# EAGLE design Huzzah-ESP8266-Motor-Driver-v1 (EAGLE 7.5.0)
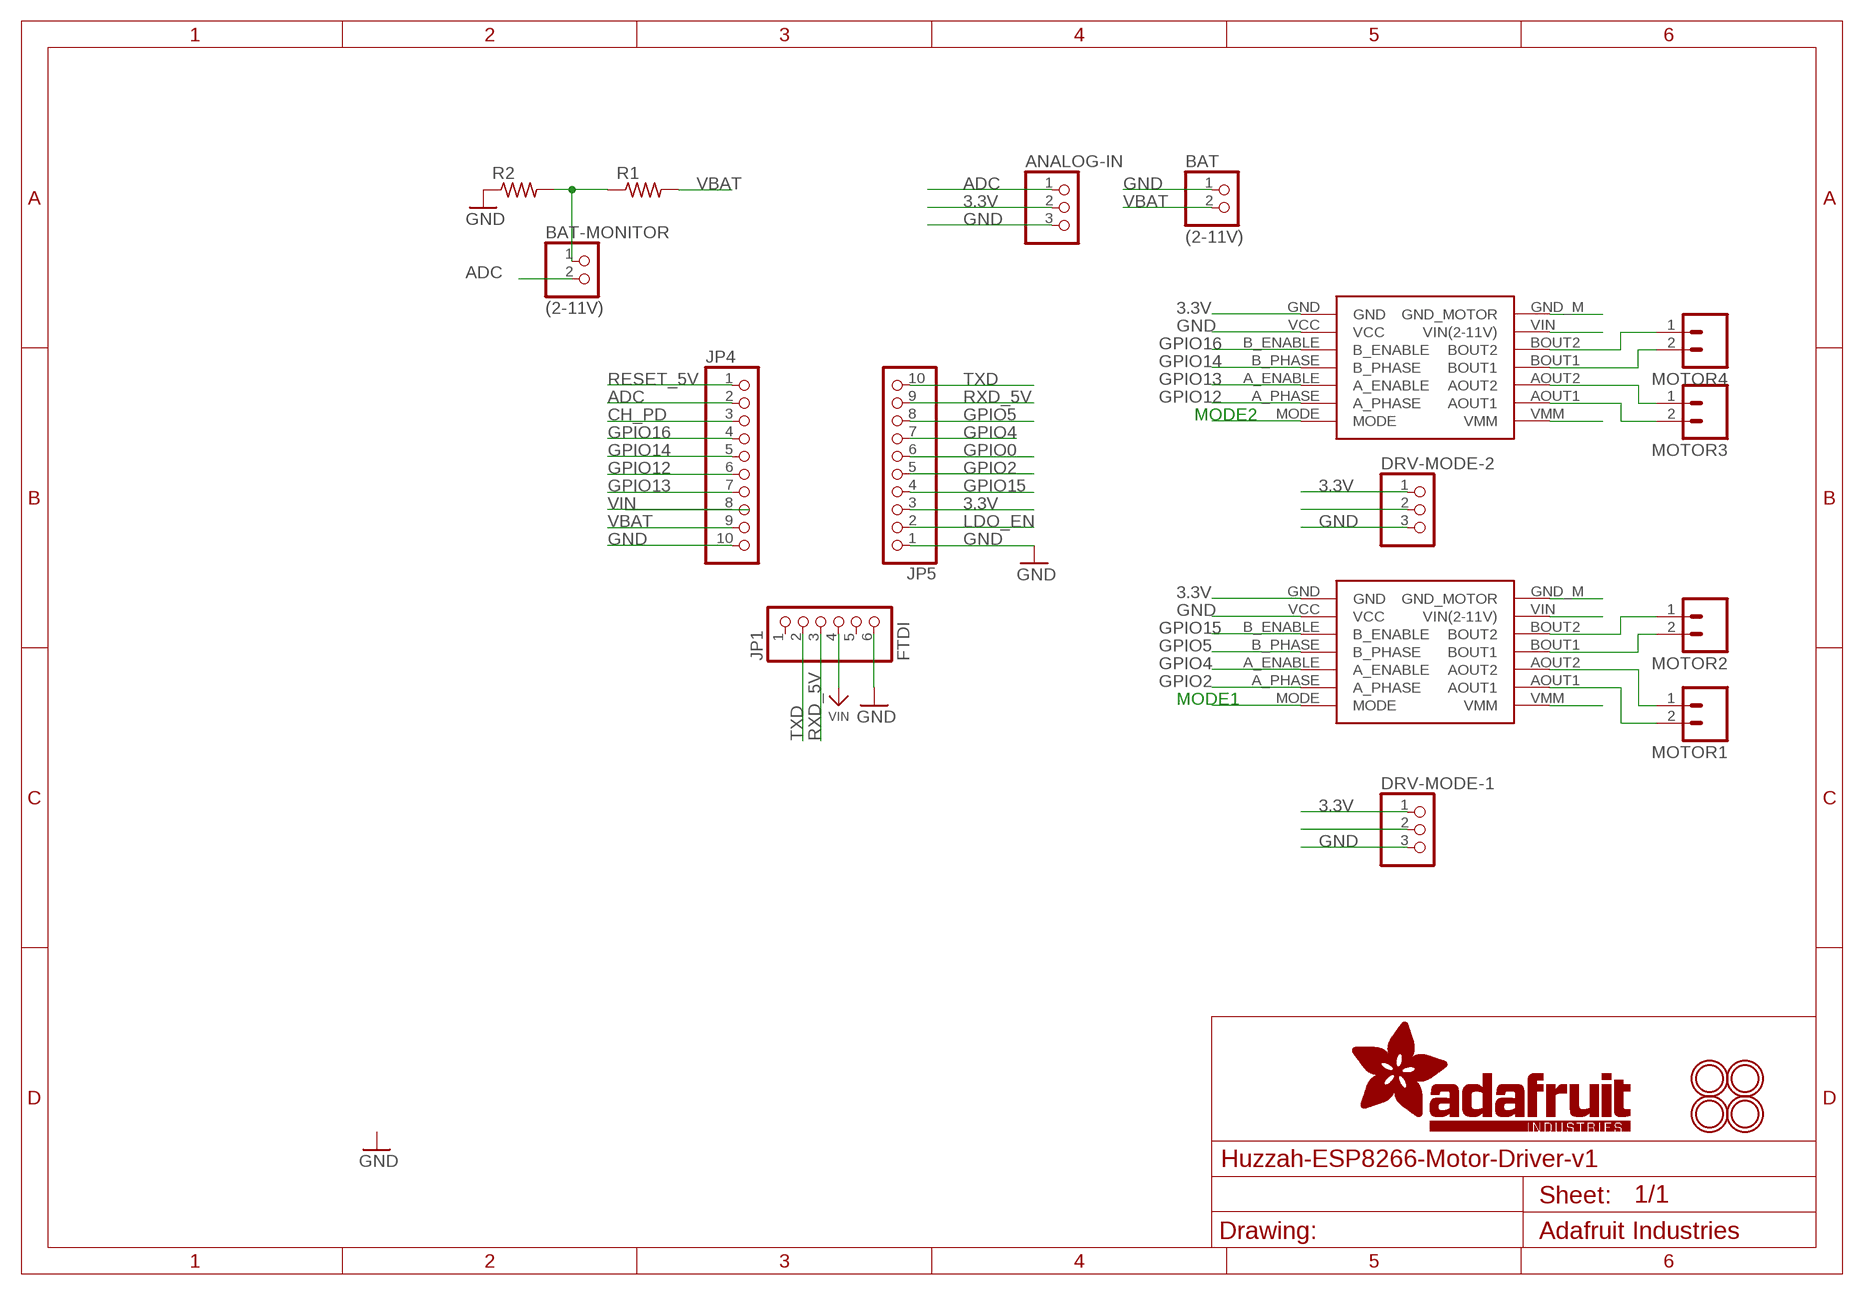
[diagram p0: schematic, sheet 1]

## Parts
ANALOG-IN  PINHD-1X3  [1X03]
BAT  (2-11V)  PINHD-1X2  [1X02]
BAT-MONITOR  (2-11V)  PINHD-1X2  [1X02]
DRV8835-1  POLOLU_DRV8835  [POLOLU_DRV8835]
DRV8835-2  POLOLU_DRV8835  [POLOLU_DRV8835]
DRV-MODE-1  PINHD-1X3  [1X03]
DRV-MODE-2  PINHD-1X3  [1X03]
JP1  FTDI  HEADER-1X670MIL  [1X06_ROUND_70]
JP4  HEADER-1X1070MIL  [1X10_ROUND70]
JP5  HEADER-1X1070MIL  [1X10_ROUND70]
MOTOR1  M02SPRING-2.54-RA  [SPRINGTERMINAL-2.54MM-2]
MOTOR2  M02SPRING-2.54-RA  [SPRINGTERMINAL-2.54MM-2]
MOTOR3  M02SPRING-2.54-RA  [SPRINGTERMINAL-2.54MM-2]
MOTOR4  M02SPRING-2.54-RA  [SPRINGTERMINAL-2.54MM-2]
R1  R-US_0204/5  [0204/5]
R2  R-US_0204/5  [0204/5]
U$15  MOUNTINGHOLE2.5  [MOUNTINGHOLE_2.5_PLATED]
U$16  MOUNTINGHOLE2.5  [MOUNTINGHOLE_2.5_PLATED]
U$17  MOUNTINGHOLE2.5  [MOUNTINGHOLE_2.5_PLATED]
U$18  MOUNTINGHOLE2.5  [MOUNTINGHOLE_2.5_PLATED]

## Nets
3.3V: ANALOG-IN.2 DRV8835-1.VCC DRV8835-2.VCC DRV-MODE-1.1 DRV-MODE-2.1 JP5.3
ADC: ANALOG-IN.1 BAT-MONITOR.2 JP4.2
CH_PD: JP4.3
GND: ANALOG-IN.3 BAT.1 DRV8835-1.GND DRV8835-1.GND_M(GND_MOTOR) DRV8835-2.GND DRV8835-2.GND_M(GND_MOTOR) DRV-MODE-1.3 DRV-MODE-2.3 JP1.6 JP4.10 JP5.1 R2.1
GPIO0: JP5.6
GPIO2: JP5.5
GPIO4: JP5.7
GPIO5: JP5.8
GPIO12: JP4.6
GPIO13: JP4.7
GPIO14: JP4.5
GPIO15: JP5.4
GPIO16: JP4.4
LDO_EN: JP5.2
MODE1: DRV8835-1.MODE
MODE2: DRV8835-2.MODE
N$1 [high-current]: DRV8835-1.AOUT1 MOTOR1.2
N$2 [high-current]: DRV8835-1.AOUT2 MOTOR1.1
N$3 [high-current]: DRV8835-1.BOUT1 MOTOR2.2
N$4 [high-current]: DRV8835-1.BOUT2 MOTOR2.1
N$5 [high-current]: DRV8835-2.AOUT1 MOTOR3.2
N$6 [high-current]: DRV8835-2.AOUT2 MOTOR3.1
N$7 [high-current]: DRV8835-2.BOUT2 MOTOR4.1
N$8: DRV8835-2.BOUT1 MOTOR4.2
N$9: DRV8835-1.A_ENABLE
N$10: DRV8835-1.A_PHASE
N$11: DRV8835-1.B_PHASE
N$12: DRV8835-1.B_ENABLE
N$13: DRV8835-2.A_PHASE
N$14: DRV8835-2.A_ENABLE
N$15: DRV8835-2.B_PHASE
N$16: DRV8835-2.B_ENABLE
N$17: BAT-MONITOR.1 R1.1 R2.2
N$19: DRV-MODE-2.2
N$20: DRV-MODE-1.2
N$21: DRV8835-2.VMM
N$24: DRV8835-1.VMM
RESET_5V: JP4.1
RXD_5V: JP1.3 JP5.9
TXD: JP1.2 JP5.10
VBAT [high-current]: BAT.2 DRV8835-1.VIN(VIN(2-11V)) DRV8835-2.VIN(VIN(2-11V)) JP4.9 R1.2
VIN: JP1.4 JP4.8
Unconnected: JP1.1 JP1.5

## Notes on the sheet
- MODE2
- MODE1

## Library data of the parts
ANALOG-IN DRV-MODE-1 DRV-MODE-2 = adafruit:PINHD-1X3: PIN HEADER
BAT BAT-MONITOR = pinhead:PINHD-1X2: PIN HEADER
DRV8835-1 DRV8835-2 = CMU-ArtFab:POLOLU_DRV8835
JP1 = microbuilder:HEADER-1X6: PIN HEADER
JP4 JP5 = microbuilder:HEADER-1X10: PIN HEADER
MOTOR1-MOTOR4 = CMU-ArtFab:M02: Header 2 Standard 2-pin 0.1" header. Use with straight break away headers (SKU : PRT-00116), right angle break away headers (PRT-00553), swiss pins (PRT-00743), machine pins (PRT-00117), and female headers (PRT-00115). Molex polarized connector foot print use with SKU : PRT-08233 with associated crimp pins and housings.
R1 R2 = resistor:R-US_: RESISTOR, American symbol
U$15-U$18 = microbuilder:MOUNTINGHOLE: Mounting Hole For #2 screws (0.086"/2.18mm width, 0.094"/2.4mm hole) use 2.5mm; BOM: EXCLUDE

## Net classes
0 default: width 0.152 mm
1 high-current: width 0.305 mm

## Board
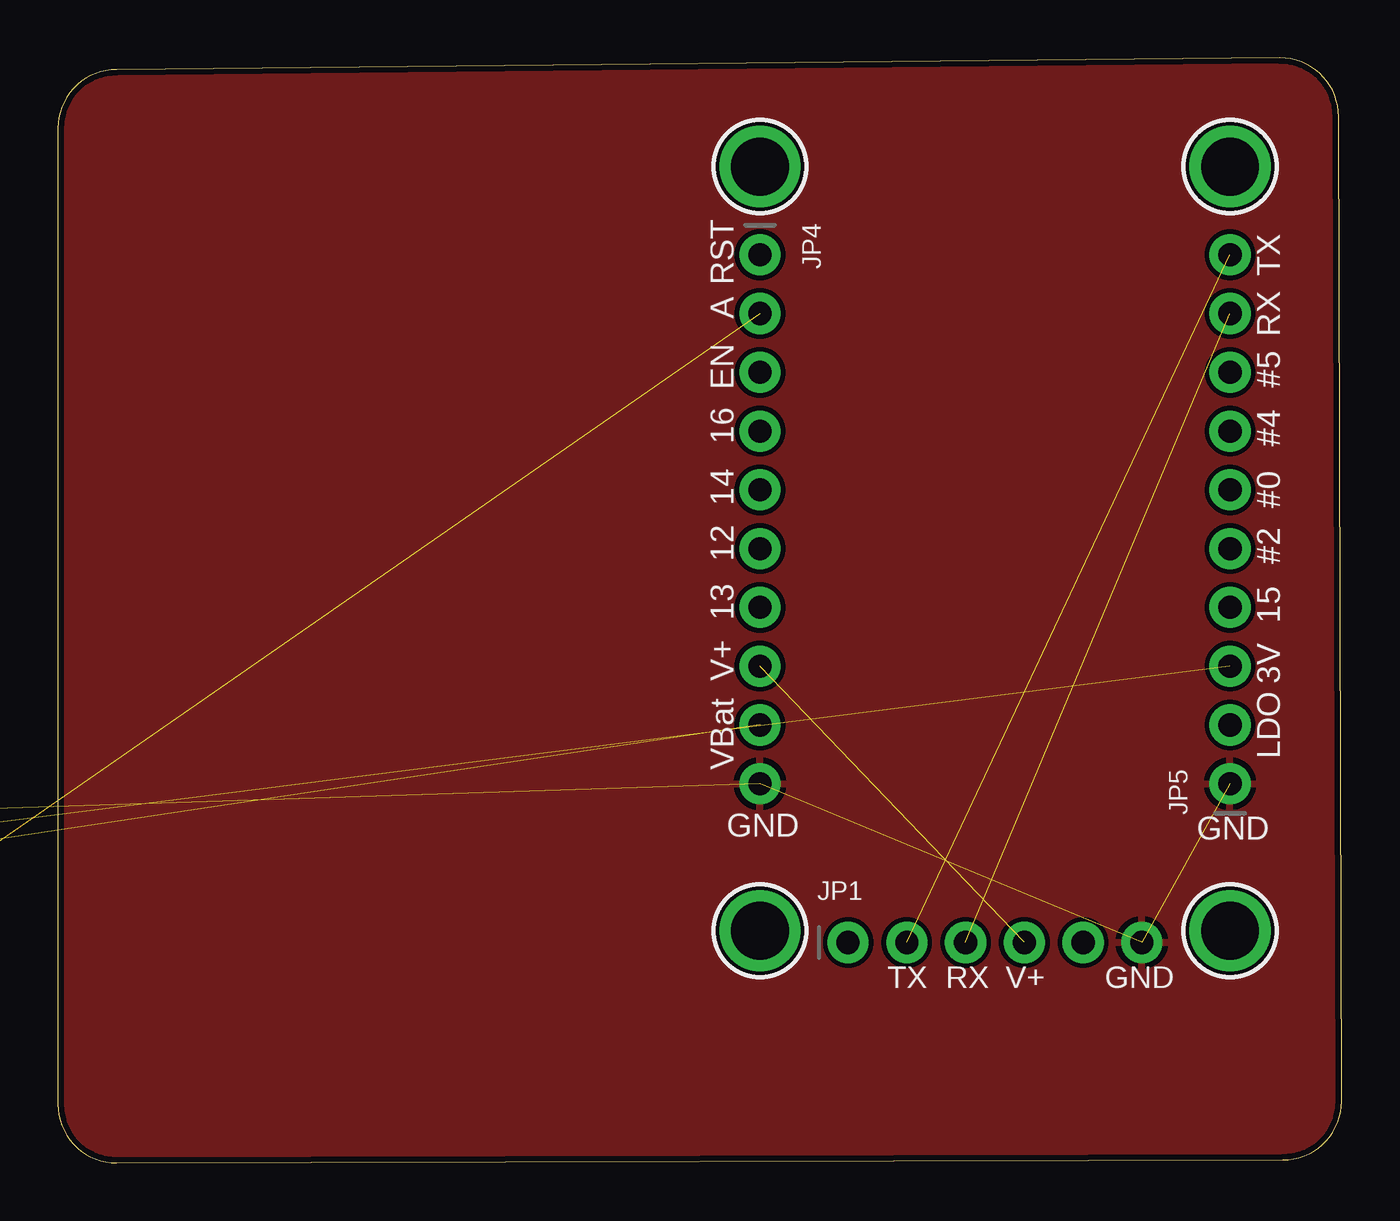
[diagram p1: board, top side]
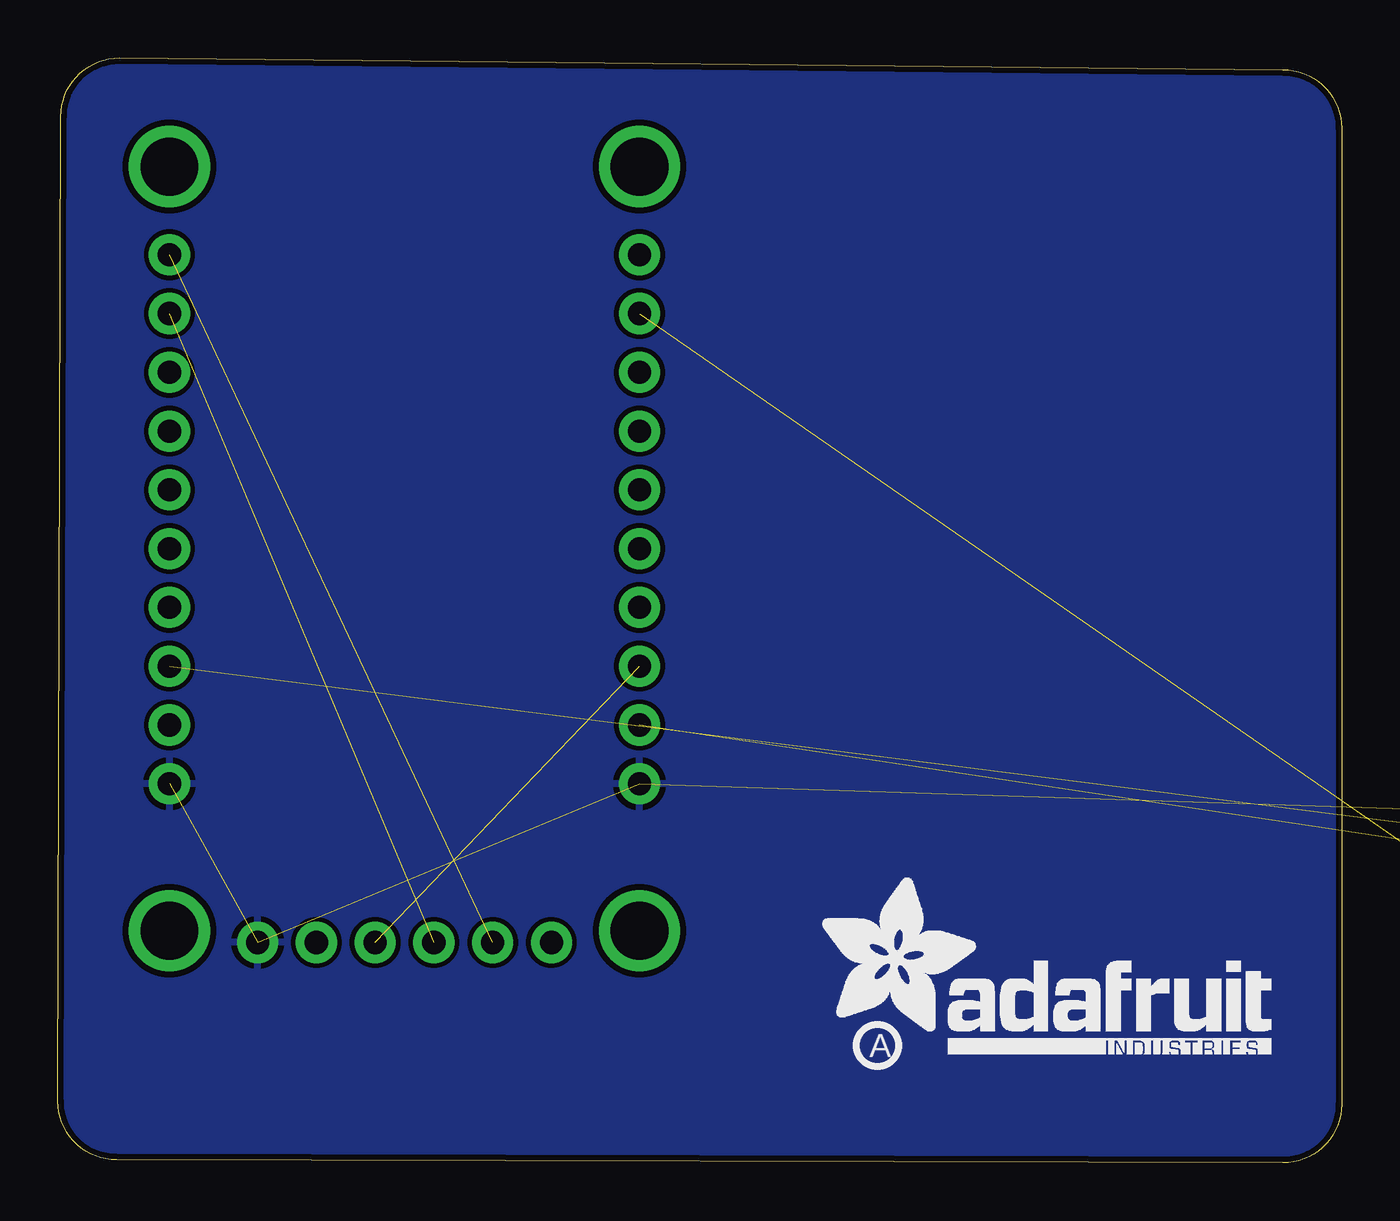
[diagram p2: board, bottom side, seen from below]

Size 55.5 x 47.75 mm. Coordinates in mm from the lower left corner, seen from the top.
Outline: 0,44.7 0,2.54 arc90 2.54,0 52.96,0.13 arc90 55.5,2.67 55.37,45.21 arc90 52.83,47.75 2.54,47.24 arc90 0,44.7
Copper layers (1*16): Top 0.035mm / dielectric 1.5mm / Bottom 0.035mm
Design rules "adafruit *": minimum track width 10mil, minimum drill 15.5mil, track to track 8mil, track to pad 8mil, pad to pad 8mil, via to via 8mil, smd to smd 8mil, copper to edge 10mil, drill to drill 8mil, minimum pad ring 10mil, minimum via ring 8mil, stop-mask expansion 2mil, vias tented up to drill 20mil, thermal gap 10mil

### Footprints (pad centres in the part's own frame; a part is rotated, then mirrored left to right if it is on the bottom)
1X03 = drill 1.016: 1 -2.54,0; 2 0,0; 3 2.54,0
1X02 = drill 1.016 long: 1 -1.27,0; 2 1.27,0
POLOLU_DRV8835 = drill 1.016 pad 1.778: A_ENABLE -3.81,-3.81; A_PHASE -3.81,-6.35; AOUT1 3.81,-6.35; AOUT2 3.81,-3.81; B_ENABLE -3.81,1.27; B_PHASE -3.81,-1.27; BOUT1 3.81,-1.27; BOUT2 3.81,1.27; MODE -3.81,-8.89; VCC -3.81,3.81; VIN 3.81,3.81; VMM 3.81,-8.89 | drill 1.016 pad 1.778 square: GND -3.81,6.35; GND_M 3.81,6.35
1X06_ROUND_70 = drill 1 pad 1.778: 1 -6.35,0; 2 -3.81,0; 3 -1.27,0; 4 1.27,0; 5 3.81,0; 6 6.35,0
1X10_ROUND70 = drill 1 pad 1.778: 1 -11.43,0; 2 -8.89,0; 3 -6.35,0; 4 -3.81,0; 5 -1.27,0; 6 1.27,0; 7 3.81,0; 8 6.35,0; 9 8.89,0; 10 11.43,0
SPRINGTERMINAL-2.54MM-2 = drill 1.1 pad 1.9: 1 0,0; 2 2.54,0; P$2 0,5.08; P$3 2.54,5.08
0204/5 = drill 0.813 octagon: 1 -2.54,0; 2 2.54,0
MOUNTINGHOLE_2.5_PLATED = drill 2.5 pad 3.2: P$1 0,0

### Placement (x,y rotation side)
ANALOG-IN  -27.56,-5.21 0 top  (outside the outline)
BAT  -60.83,-20.07 0 top  (outside the outline)
BAT-MONITOR  -60.83,-34.42 0 top  (outside the outline)
DRV8835-1  -26.92,8.64 0 top  (outside the outline)
DRV8835-2  -16.64,8.64 0 top  (outside the outline)
DRV-MODE-1  -59.56,-10.16 0 top  (outside the outline)
DRV-MODE-2  -59.56,-15.11 0 top  (outside the outline)
JP1  40.51,9.53 0 top
JP4  30.35,27.81 270 top
JP5  50.67,27.81 90 top
MOTOR1  -43.69,-1.65 0 top  (outside the outline)
MOTOR2  -35.69,-1.65 0 top  (outside the outline)
MOTOR3  -59.69,-1.65 0 top  (outside the outline)
MOTOR4  -51.69,-1.65 0 top  (outside the outline)
R1  -60.33,-26.29 0 top  (outside the outline)
R2  -60.33,-29.84 0 top  (outside the outline)
U$2  [HUZZAHLOGO]  21.59,30.61 0 bottom
U$12  [ADAFRUIT_TEXT_20MM]  22.61,4.7 0 bottom
U$13  [PCBFEAT-REV-040]  20.07,5.08 0 bottom
U$15  50.67,43.05 0 top
U$16  30.35,43.05 0 top
U$17  50.67,10.03 0 top
U$18  30.35,10.03 0 top

### Tracks (layer width: path | path; a pad name or v marks a point on that pad's centre or on a via)
3.3V  (5 unrouted)
ADC  (2 unrouted)
GND  (11 unrouted)
  pour Top: 0,0 0.13,47.24 55.63,47.5 55.5,0.25
  pour Bottom: 0,0 0,47.37 55.5,47.62 55.5,0.25
N$1  (1 unrouted)
N$2  (1 unrouted)
N$3  (1 unrouted)
N$4  (1 unrouted)
N$5  (1 unrouted)
N$6  (1 unrouted)
N$7  (1 unrouted)
N$8  (1 unrouted)
N$17  (2 unrouted)
RXD_5V  (1 unrouted)
TXD  (1 unrouted)
VBAT  (4 unrouted)
VIN  (1 unrouted)

### Text on the board
tPlace: RST | TX | A | RX | EN | #5 | 16 | #4 | 14 | #0 | 12 | #2 | 13 | 15 | V+ | 3V | VBat | LDO | GND | GND | TX | RX | V+ | GND